# Altium schematic sheet OpenMEA_Power_V002.SchDoc
size A1
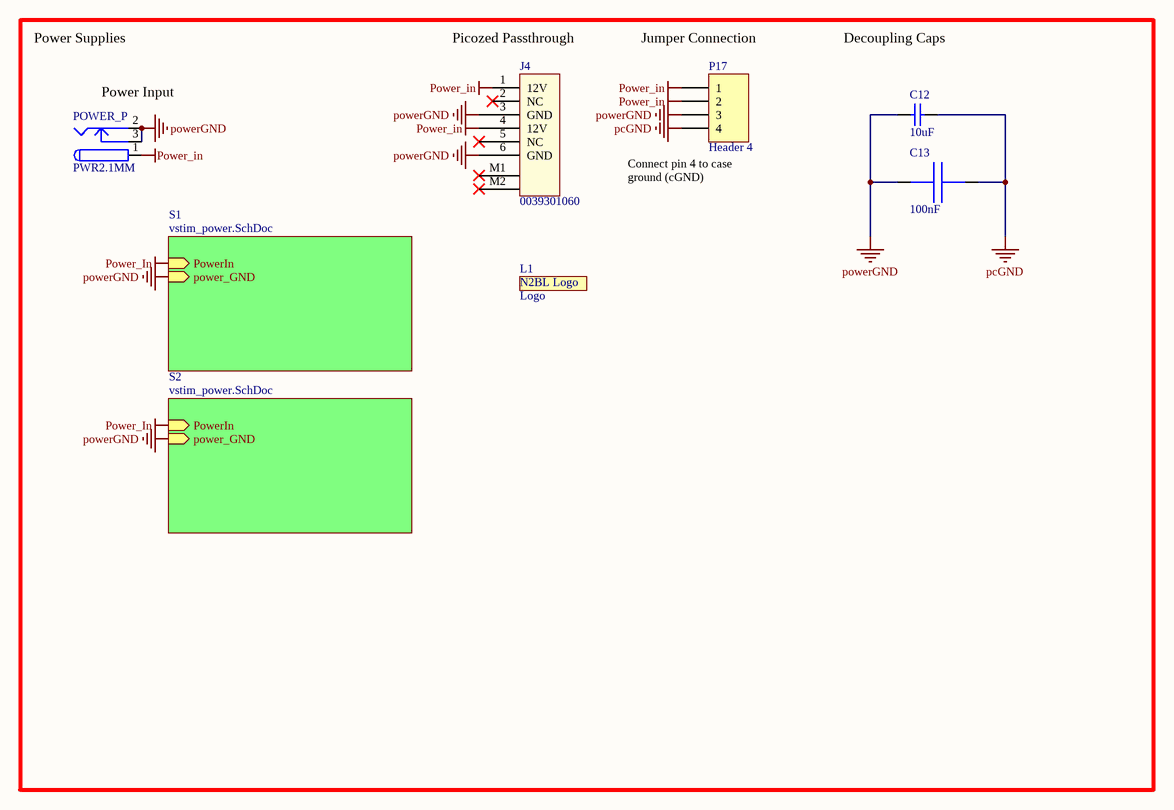
[diagram p0: OpenMEA_Power_V002.SchDoc]

## Parts
C12  10uF  [C0805]
C13  value 100nF  [rcl_0402i_1005m_most]  (hidden comment: capacitor_npol_ame)
J4  0039301060  [0039301060]
L1  Logo  [N2BL_LOGO]
P17  Header 4  [OSTVN04A150]
POWER_P  PWR2.1MM  [POWER2.1MM]

## Sub-sheets
S1 = vstim_power.SchDoc: PowerIn (in), power_GND (in)
S2 = vstim_power.SchDoc: PowerIn (in), power_GND (in)

## Nets
pcGND: C12.1 C13.1 P17.4
Power_In: J4.1(12V) J4.4(12V) P17.1 P17.2 POWER_P.1 ; sheet S1/PowerIn, sheet S2/PowerIn
powerGND: C12.2 C13.2 J4.3(GND) J4.6(GND) P17.3 POWER_P.2 POWER_P.3 ; sheet S1/power_GND, sheet S2/power_GND

Not connected (* = marked no-connect by the designer): J4 2(NC)* 5(NC)* M1* M2*

## Notes on the sheet
- Power Supplies
- (near J4) Picozed Passthrough
- (near P17) Jumper Connection
- Decoupling Caps
- (near POWER_P) Power Input
- (near P17) Connect pin 4 to case ground (cGND)
- (in symbol Neuron To Brain Lab Logo) N2BL Logo

## Library data of the parts
C12 = C2012X5R1E106K085AC: CAP 10UF; Manufacturer: Samsung Electro-Mechanics; Manufacturer Part Number: CL21A106KAYNNNE; Dielectric Material: Ceramic; Tolerance: 10%; Voltage Rating: 25V; Dielectric: X5R; Supplier 1: Digi-Key; Stock 1: 843; Pricing 1: 1=0.39;  10=0.264;  100=0.13340;  500=0.09128;  1000=0.08075  (CAD); Mount: Surface Mount; Case/Package: 0805; Case Code (Metric): 2012; Case Code (Imperial): 0805; Min Operating Temperature: -55°C; Max Operating Temperature: 85°C; Packaging: Tape and Reel; Capacitance: 10uF; Termination: SMD/SMT; Voltage Rating (DC): 25V; Length: 0.079inch; Width: 0.049inch; Thickness: 1.25mm; Lead Free: Lead Free; ComponentLink1URL: http://www.samsungsem.com/kr/support/product-search/mlcc/__icsFiles/afieldfile/2018/06/20/CL21A106KAYNNNE.pdf; ComponentLink1Description: Specifications; ComponentLink2URL: https://media.digikey.com/pdf/Data%20Sheets/Samsung%20PDFs/CL21A106KAYNNNE_Char.pdf; ComponentLink2Description: Characteristics; ComponentLink3URL: https://media.digikey.com/pdf/Data%20Sheets/Samsung%20PDFs/CL_Series_MLCC_ds.pdf; ComponentLink3Description: Datasheet; Supplier Part Number 1: 1276-2891-1-ND; Supplier Link 1: https://www.digikey.ca/product-detail/en/samsung-electro-mechanics/CL21A106KAYNNNE/1276-2891-1-ND/3890977
C13 = capacitor_npol_ame: Capacitor Non-polarized American Symbol; Manufacturer: Yageo; Manuracturer Part Number: CC0402KRX7R8BB104; Voltage Rating: 25V; Priging 1: 1 	0.15000 	$0.15 (CAD); Package: 0402; Supplier 1: Digikey; Supplier Part Number 1: 311-2077-1-ND; Supplier Link 1: https://www.digikey.ca/product-detail/en/yageo/CC0402KRX7R8BB104/311-2077-1-ND/5698948; Stock 1: 143,749; ComponentLink1URL: http://www.yageo.com/documents/recent/UPY-GPHC_X7R_6.3V-to-50V_18.pdf; ComponentLink1Description: Datasheet; Supplier Description 1: CAP CER 0.1UF 25V X7R 0402
J4 = 0039301060: CONN HEADER R/A 6POS 4.2MM; Manufacturer: Molex; Pricing1: 1  1.41000  $1.41  10  1.25000  $12.50  100  1.07790  $107.79  500  0.88194  $440.97  1,000  0.78394  $783.94  5,000  0.68595  $3,429.73  10,000  0.65165  $6,516.48 (CAD); Manufacturer Part Number: 0039301060; Supplier Link 1: https://www.digikey.ca/product-detail/en/molex/0039301060/WM1353-ND/561080; Supplier 1: Digikey; Supplier Part Number 1: WM1353-ND; Stock1: 8,844; ComponentLink1URL: https://www.molex.com/pdm_docs/sd/039301060_sd.pdf; ComponentLink1Description: Datasheet
L1 = Neuron To Brain Lab Logo
P17 = Header 4: Header, 4-Pin; Manufacturer: On Shore Technology Inc.; Detailed Description: 4 Position Wire to Board Terminal Block Horizontal with Board 0.100" (2.54mm) Through Hole; Pitch (Imperial): 100mil; LatestRevisionDate: 17-Jul-2002; LatestRevisionNote: Re-released for DXP Platform.; Publisher: Altium Limited; Manufacturer Part Number: OSTVN04A150; Manufacturer Link: https://www.on-shore.com/part/ostvnxxa150-terminal-block-one-piece-rising-clamp/; Supplier 1: Digikey; Supplier Link 1: https://www.digikey.com/product-detail/en/on-shore-technology-inc/OSTVN04A150/ED10563-ND/1588864; Supplier Part Number 1: ED10563-ND; Pricing 1: 1  1.38000  $1.38  10  0.96900  $9.69  25  0.90400  $22.60  50  0.82040  $41.02  100  0.81680  $81.68  250  0.68972  $172.43  500  0.65340  $326.70  1,000  0.58080  $580.80  5,000  0.47190  $2,359.50 (CAD); Stock 1: 8,195; ComponentLink1URL: http://www.on-shore.com/wp-content/uploads/OSTVNXXA150.pdf; ComponentLink1Description: Datasheet
POWER_P = PWR2.1MM: PJ-002AH; Manufacturer: CUI; Gender: Male; Shielding: Unshielded; Connector Type: Jack; Current Rating: 5A; Number of Conductors: 2; Voltage Rating: 24V; Insulation Resistance: 50MR; Supplier 1: Digi-Key; Manufacturer Part Number: PJ-002AH; Stock 1: 95768; Pricing 1: 1=0.74, 10=0.696, 25=0.6264, 50=0.5568, 100=0.5336, 250=0.4872, 500=0.464, 1000=0.3828, 2500=0.348 (USD); Mount: Through Hole; Colour: Black; Contact Material: Copper,Copper Alloy; Contact Plating: Nickel; Housing Material: Thermoplastic; Housing Colour: Black; Min Operating Temperature: -25°C; Max Operating Temperature: 85°C; Packaging: Bulk; Termination: Through Hole; Orientation: Horizontal; Package Quantity: 500; Contact Gender: Male; Diameter: 2.1mm; Lead Free: Lead Free; Flammability Rating: UL94 V-0; ComponentLink1URL: http://www.cui.com/Product/Resource/FuturePDF/PJ-002AH.pdf; ComponentLink1Description: http://www.cui.com/Product/Resource/FuturePDF/PJ-002AH.pdf; ComponentLink2URL: http://www.cui.com/product/resource/digikeypdf/pj-002ah.pdf; ComponentLink2Description: http://www.cui.com/product/resource/digikeypdf/pj-002ah.pdf; ComponentLink3URL: http://www.mouser.com/ds/2/670/pj-002ah-516007.pdf; ComponentLink3Description: http://www.mouser.com/ds/2/670/pj-002ah-516007.pdf; Supplier Part Number 1: CP-002AH-ND; Supplier Link 1: https://www.digikey.ca/products/en?keywords=CP-002AH-ND